# EAGLE design BR103_MKL_3357_Motorraumbeleuchtung_J1_006_03_03 (EAGLE 5.10)
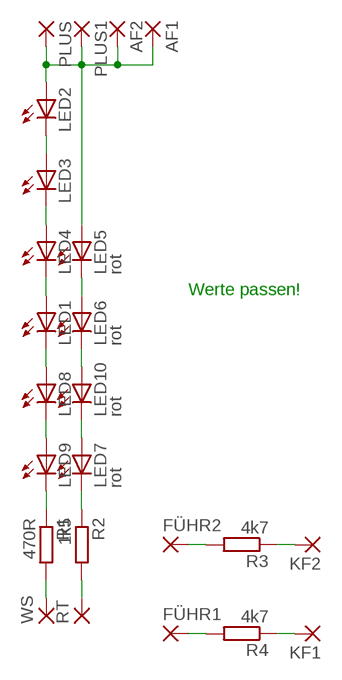
[diagram p0: schematic, sheet 1]

## Parts
AF1  SMD2  [SMD1,27-2,54]
AF2  SMD2  [SMD1,27-2,54]
FÜHR1  SMD2  [SMD1,27-2,54]
FÜHR2  SMD2  [SMD1,27-2,54]
KF1  SMD2  [SMD1,27-2,54]
KF2  SMD2  [SMD1,27-2,54]
LED1  LEDCHIPLED_0603-JP  [CHIPLED-0603-JP]
LED2  LEDCHIPLED_0603-JP  [CHIPLED-0603-JP]
LED3  LEDCHIPLED_0603-JP  [CHIPLED-0603-JP]
LED4  LEDCHIPLED_0603-JP  [CHIPLED-0603-JP]
LED5  rot  LEDCHIP-LED0603  [CHIP-LED0603]
LED6  rot  LEDCHIP-LED0603  [CHIP-LED0603]
LED7  rot  LEDCHIP-LED0603  [CHIP-LED0603]
LED8  LEDCHIPLED_0603-JP  [CHIPLED-0603-JP]
LED9  LEDCHIPLED_0603-JP  [CHIPLED-0603-JP]
LED10  rot  LEDCHIP-LED0603  [CHIP-LED0603]
PLUS  SMD2  [SMD1,27-2,54]
PLUS1  SMD2  [SMD1,27-2,54]
R1  470R  R-EU_R0603S  [R0603S]
R2  1k5  R-EU_R0603S  [R0603S]
R3  4k7  R-EU_R0603S  [R0603S]
R4  4k7  R-EU_R0603S  [R0603S]
RT  SMD2  [SMD1,27-2,54]
WS  SMD2  [SMD1,27-2,54]

## Nets
N$1: LED8.C LED9.A
N$2: LED1.C LED8.A
N$3: LED1.A LED4.C
N$4: LED3.C LED4.A
N$5: LED2.C LED3.A
N$7: LED6.C LED10.A
N$8: LED5.C LED6.A
N$9: LED7.C R2.1
N$10: LED9.C R1.1
N$11: KF2.1(P) R3.1
N$12: KF1.1(P) R4.1
N$15: FÜHR2.1(P) R3.2
N$16: FÜHR1.1(P) R4.2
N$17: LED7.A LED10.C
PLUS: AF1.1(P) AF2.1(P) LED2.A LED5.A PLUS1.1(P) PLUS.1(P)
RT: R2.2 RT.1(P)
WS: R1.2 WS.1(P)

## Notes on the sheet
- Werte passen!

## Library data of the parts
AF1 AF2 FÜHR1 FÜHR2 KF1 KF2 PLUS PLUS1 RT WS = wirepad:SMD2: SMD PAD
LED1-LED10 = led:LED: LED OSRAM: - CHIPLED LG R971, LG N971, LY N971, LG Q971, LY Q971, LO R971, LY R971 LH N974, LH R974 LS Q976, LO Q976, LY Q976 LO Q996 - Hyper CHIPLED LW Q18S LB Q993, LB Q99A, LB R99A - SideLED LS A670, LO A670, LY A670, LG A670, LP A670 LB A673, LV A673, LT A673, LW A673 LH A674 LY A675 LS A676, LA A676, LO A676, LY A676, LW A676 LS A679, LY A679, LG A679 - Hyper Micro SIDELED® LS Y876, LA Y876, LO Y876, LY Y876 LT Y87S - SmartLED LW L88C, LW L88S LB L89C, LB L89S, LG L890 LS L89K, LO L89K, LY L89K LS L896, LA L896, LO L896, LY L896 - TOPLED LS T670, LO T670, LY T670, LG T670, LP T670 LSG T670, LSP T670, LSY T670, LOP T670, LYG T670 LG T671, LOG T671, LSG T671 LB T673, LV T673, LT T673, LW T673 LH T674 LS T676, LA T676, LO T676, LY T676, LB T676, LH T676, LSB T676, LW T676 LB T67C, LV T67C, LT T67C, LS T67K, LO T67K, LY T67K, LW E67C LS E67B, LA E67B, LO E67B, LY E67B, LB E67C, LV E67C, LT E67C LW T67C LS T679, LY T679, LG T679 LS T770, LO T770, LY T770, LG T770, LP T770 LB T773, LV T773, LT T773, LW T773 LH T774 LS E675, LA E675, LY E675, LS T675 LS T776, LA T776, LO T776, LY T776, LB T776 LHGB T686 LT T68C, LB T68C - Hyper Mini TOPLED® LB M676 - Mini TOPLED Santana® LG M470 LS M47K, LO M47K, LY M47K Source: http://www.osram.convergy.de LUXEON: - LUMILED® LXK2-PW12-R00, LXK2-PW12-S00, LXK2-PW14-U00, LXK2-PW14-V00 LXK2-PM12-R00, LXK2-PM12-S00, LXK2-PM14-U00 LXK2-PE12-Q00, LXK2-PE12-R00, LXK2-PE12-S00, LXK2-PE14-T00, LXK2-PE14-U00 LXK2-PB12-K00, LXK2-PB12-L00, LXK2-PB12-M00, LXK2-PB14-N00, LXK2-PB14-P00, LXK2-PB14-Q00 LXK2-PR12-L00, LXK2-PR12-M00, LXK2-PR14-Q00, LXK2-PR14-R00 LXK2-PD12-Q00, LXK2-PD12-R00, LXK2-PD12-S00 LXK2-PH12-R00, LXK2-PH12-S00 LXK2-PL12-P00, LXK2-PL12-Q00, LXK2-PL12-R00 Source: www.luxeon.com KINGBRIGHT: KA-3528ASYC Source: www.kingbright.com
R1-R4 = rcl:R-EU_: RESISTOR, European symbol

## Board
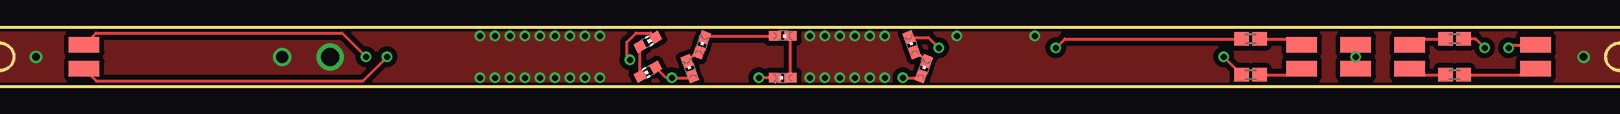
[diagram p1: board, top side]
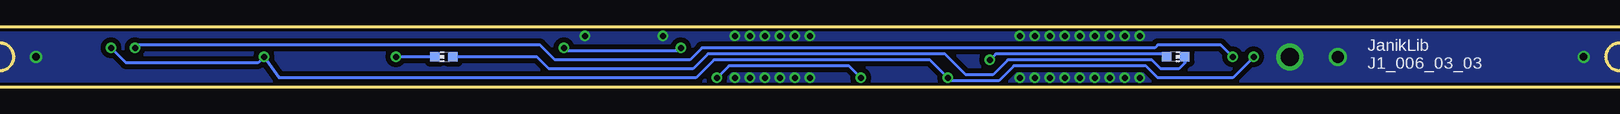
[diagram p2: board, bottom side, seen from below]

No outline drawn. Coordinates in mm, seen from the top.
Copper layers (1*16): Top 0.035mm / dielectric 1.5mm / Bottom 0.035mm
Design rules "default": minimum track width 10mil, minimum drill 24mil, track to track 8mil, track to pad 8mil, pad to pad 8mil, via to via 8mil, smd to smd 8mil, copper to edge 40mil, drill to drill 8mil, minimum pad ring 10mil, minimum via ring 8mil, stop-mask expansion 4mil, vias tented up to drill 0mil, thermal gap 10mil
Milling: 18 lines

### Footprints (pad centres in the part's own frame; a part is rotated, then mirrored left to right if it is on the bottom)
SMD1,27-2,54 = smd 1.27 x 2.54: 1 0,0
CHIPLED-0603-JP = smd 0.8 x 1: A 0,-0.65; C 0,0.65
CHIP-LED0603 = smd 0.8 x 0.8: A 0,-0.75; C 0,0.75
R0603S = smd 1.2 x 1.1: 1 -0.75,0; 2 0.75,0

### Placement (x,y rotation side)
AF1  10,3.5 90 top
AF2  131,3.5 90 top
FÜHR1  120.5,3.5 90 top
FÜHR2  120.5,1.5 90 top
KF1  10,1.5 90 top
KF2  131,1.5 90 top
LED1  68.25,0.75 90 top
LED2  60.5,1.5 20 top
LED3  61.5,3.5 340 top
LED4  68.25,4.25 270 top
LED5  57,1.25 120 top
LED6  57,3.75 300 top
LED7  101,2.5 90 bottom
LED8  80,1.5 340 top
LED9  79,3.5 20 top
LED10  40,2.5 270 bottom
PLUS  116,3.5 270 top
PLUS1  116,1.5 90 top
R1  107.25,4 0 top
R2  107.25,1 0 top
R3  124.25,1 180 top
R4  124.25,4 180 top
RT  111.5,1.5 90 top
WS  111.5,3.5 270 top

### Tracks (layer width: path | path; a pad name or v marks a point on that pad's centre or on a via)
DACH  (via drill 0.5, 0.6, 1, 1.5)
  other vias: 6,2.5 70.5,0.75 43,0.75 43,4.25 45.5,0.75 44.25,0.75 44.25,4.25 45.5,4.25 48,0.75 46.75,0.75 46.75,4.25 48,4.25 49.25,0.75 50.5,0.75 50.5,4.25 49.25,4.25 53,0.75 51.75,0.75 53,4.25 51.75,4.25 70.5,4.25 73,0.75 71.75,0.75 73,4.25 71.75,4.25 75.5,0.75 74.25,0.75 75.5,4.25 74.25,4.25 76.75,0.75 76.75,4.25 82.75,4.25 89.25,4.25 135,2.5 26.5,2.5 30.5,2.5
  pour Bottom (isolate 0.406): 2.5,4.5 138.5,4.5 arc-90 140.5,2.5 arc-90 138.5,0.5 7,0.5 2.5,0.5 arc-90 0.5,2.5 arc-90
  pour Top (isolate 0.406): 2.5,4.5 138.5,4.5 arc-90 140.5,2.5 arc-90 138.5,0.5 7,0.5 2.5,0.5 arc-90 0.5,2.5 arc-90
N$1
  Top 0.254: LED8.C 79.44,2.89 LED9.A
N$2  (via drill 0.5)
  Top 0.254: LED1.C v66.25,0.75 | v78.25,0.75 79.64,0.75 LED8.A
  Bottom 0.254: v66.25,0.75 67.25,1.75 77.25,1.75 v78.25,0.75
N$3
  Top 0.254: LED1.A LED4.C
N$4
  Top 0.254: LED4.A 61.86,4.25 LED3.C
N$5
  Top 0.254: LED3.A 61.06,2.89 LED2.C
N$7  (via drill 0.5)
  Top 0.254: LED6.C 57.62,4.12 57.25,4.5 56,4.5 55.25,3.75 55.25,2.5 v55.5,2.25
  Bottom 0.254: v55.5,2.25 55,2.75 41,2.75 LED10.A
N$8
  Top 0.254: LED5.C LED6.A
N$9  (via drill 0.5)
  Top 0.254: v105,2.5 R2.1
  Bottom 0.254: LED7.C v105,2.5
N$10  (via drill 0.5)
  Top 0.254: LED9.C 80.39,4.11 v81.25,3.25 | R1.1 91.75,4 v91,3.25
  Bottom 0.254: v81.25,3.25 81.5,3 90.75,3 v91,3.25
N$11
  Top 0.254: R3.1 130.5,1 KF2.1
N$12  (via drill 0.5)
  Top 0.254: KF1.1 11,0.5 33.25,0.5 v35.25,2.5 | 126.5,3.5 v126.75,3.25 126,4 R4.1
  Bottom 0.254: v35.25,2.5 36.25,3.5 41.5,3.5 41.75,3.25 79.5,3.25 80.5,2.25 91.75,2.25 93,3.5 126.5,3.5 v126.75,3.25
N$15
  Top 0.254: R3.2 121,1 FÜHR2.1
N$16
  Top 0.254: R4.2 121,4 FÜHR1.1
N$17
  Bottom 0.254: LED7.A 93.25,2.5 92.25,1.5 80.25,1.5 79,2.75 59.25,2.75 57.5,1 55.25,1 54,2.25 42,2.25 41.25,1.5 39.75,1.5 39.25,2 LED10.C
PLUS  (via drill 0.5)
  Top 0.254: LED5.A 58.52,0.75 v59,0.75 60.58,0.75 LED2.A | AF1.1 11,4.5 31.5,4.5 v33.5,2.5 | v128.75,3.25 129,3.5 AF2.1
  Top 0.406: PLUS.1 v116,2.5 PLUS1.1
  Bottom 0.254: v33.5,2.5 35.25,0.75 41.5,0.75 42.5,1.75 53.5,1.75 54.75,0.5 58.75,0.5 v59,0.75 60.5,2.25 78.5,2.25 80,0.75 114.75,0.75 v116,2.5 116.5,2 127.5,2 v128.75,3.25
RT
  Top 0.254: R2.2 111,1 RT.1
WS
  Top 0.254: R1.2 111,4 WS.1

### Text on the board
bNames: JanikLib | J1_006_03_03
tStop: A | BR103 Motorraumbeleuchtung | ws | F1 | A | für Märklin 3357 | Servo | F1 | K | design by Janik Merz | rt | F2 | K | F2
bStop: design by Janik Merz
Measures: 2,1 / 2,6
Document: 2,854V / LED => 7 LEDs